# Altium schematic sheet MECH.SchDoc
size 431 x 279 mm; DocumentNumber: 11; SheetNumber: 12; SheetTotal: 13
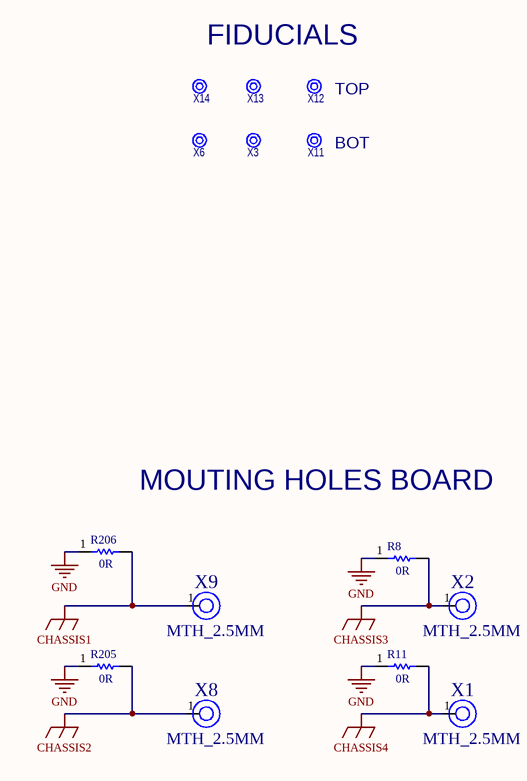
[diagram p0: MECH.SchDoc]

## Parts
R8  value 0R  [0402]  (hidden comment: RCS04020000Z0ED)
R11  value 0R  [0402]  (hidden comment: RCS04020000Z0ED)
R205  value 0R  [0402]  (hidden comment: RCS04020000Z0ED)
R206  value 0R  [0402]  (hidden comment: RCS04020000Z0ED)
X1  MTH_2.5MM  [MTH-M2.5mm - CHASSIS]  (no BOM)
X2  MTH_2.5MM  [MTH-M2.5mm - CHASSIS]  (no BOM)
X3  FIDUCIAL  [FIDUCIAL]  (value not drawn)  (no BOM)
X6  FIDUCIAL  [FIDUCIAL]  (value not drawn)  (no BOM)
X8  MTH_2.5MM  [MTH-M2.5mm - CHASSIS]  (no BOM)
X9  MTH_2.5MM  [MTH-M2.5mm - CHASSIS]  (no BOM)
X11  FIDUCIAL  [FIDUCIAL]  (value not drawn)  (no BOM)
X12  FIDUCIAL  [FIDUCIAL]  (value not drawn)  (no BOM)
X13  FIDUCIAL  [FIDUCIAL]  (value not drawn)  (no BOM)
X14  FIDUCIAL  [FIDUCIAL]  (value not drawn)  (no BOM)

## Nets
CHASSIS1: R206.2 X9.1
CHASSIS2: R205.2 X8.1
CHASSIS3: R8.2 X2.1
CHASSIS4: R11.2 X1.1
GND: R8.1 R11.1 R205.1 R206.1

## Notes on the sheet
- FIDUCIALS
- (near X12) TOP
- (near X11) BOT
- MOUTING HOLES BOARD
- REVISION
- DESCRIPTION
- DATE
- DESIGNED:
- CHECKED:
- TITLE:
- FILE NAME:
- CUR REV:
- PCB:
- SHEET:
- DATE:
- OF

## Library data of the parts
R8 R11 R205 R206 = 0R_1/5W_0402_RCS04020000Z0ED_RES: VISHAY - RCS04020000Z0ED - SMD Chip Resistor, 0402 [1005 Metric], 0 ohm, RCS Series, 50 V, Thick Film, 200 mW; Manufacturer: Vishay Dale; Resistance: 0mR; Max Power Dissipation: 200mW; Supplier 1: Digi-Key; Manufacturer Part Number: RCS04020000Z0ED; RoHS: Yes; Category: Chip SMD Resistors; Stock 1: 18214; Pricing 1: 1=0.10000, 10=0.08300, 25=0.05760, 50=0.04480, 100=0.03200, 250=0.02496, 500=0.01984, 1000=0.01408, 5000=0.01088 (USD); Case/Package: 0402; Case Code (Metric): 1005; Case Code (Imperial): 0402; Min Operating Temperature: -55°C; Max Operating Temperature: 155°C; Packaging: Tape and Reel; Resistor Type: Thick Film; Number of Terminations: 2; Features: Automotive AEC-Q200; Length: 0.039inch; Width: 0.02inch; Height: 0.016inch; RoHS Compliant: Yes; ComponentLink1URL: http://www.farnell.com/datasheets/2618474.pdf?src-supplier=Farnell; ComponentLink1Description: http://www.farnell.com/datasheets/2618474.pdf?src-supplier=Farnell; ComponentLink2URL: http://www.vishay.com/docs/20065/rcse3.pdf?src-supplier=Digi-Key; ComponentLink2Description: http://www.vishay.com/docs/20065/rcse3.pdf?src-supplier=Digi-Key; ComponentLink3URL: http://www.farnell.com/datasheets/2618474.pdf?src-supplier=Element14; ComponentLink3Description: http://www.farnell.com/datasheets/2618474.pdf?src-supplier=Element14; ComponentLink4URL: http://www.farnell.com/datasheets/2618474.pdf?src-supplier=Newark; ComponentLink4Description: http://www.farnell.com/datasheets/2618474.pdf?src-supplier=Newark; Supplier Part Number 1: 541-2877-1-ND
X1 X2 X8 X9 = MTH_2.5MM: FORWARD_PCB: 1; PKG_TYPE: MTH_2.5MM; STATUS: NOT INSTALLED